# EAGLE schematic PlaneSimulatorIO (EAGLE 9.6.2)
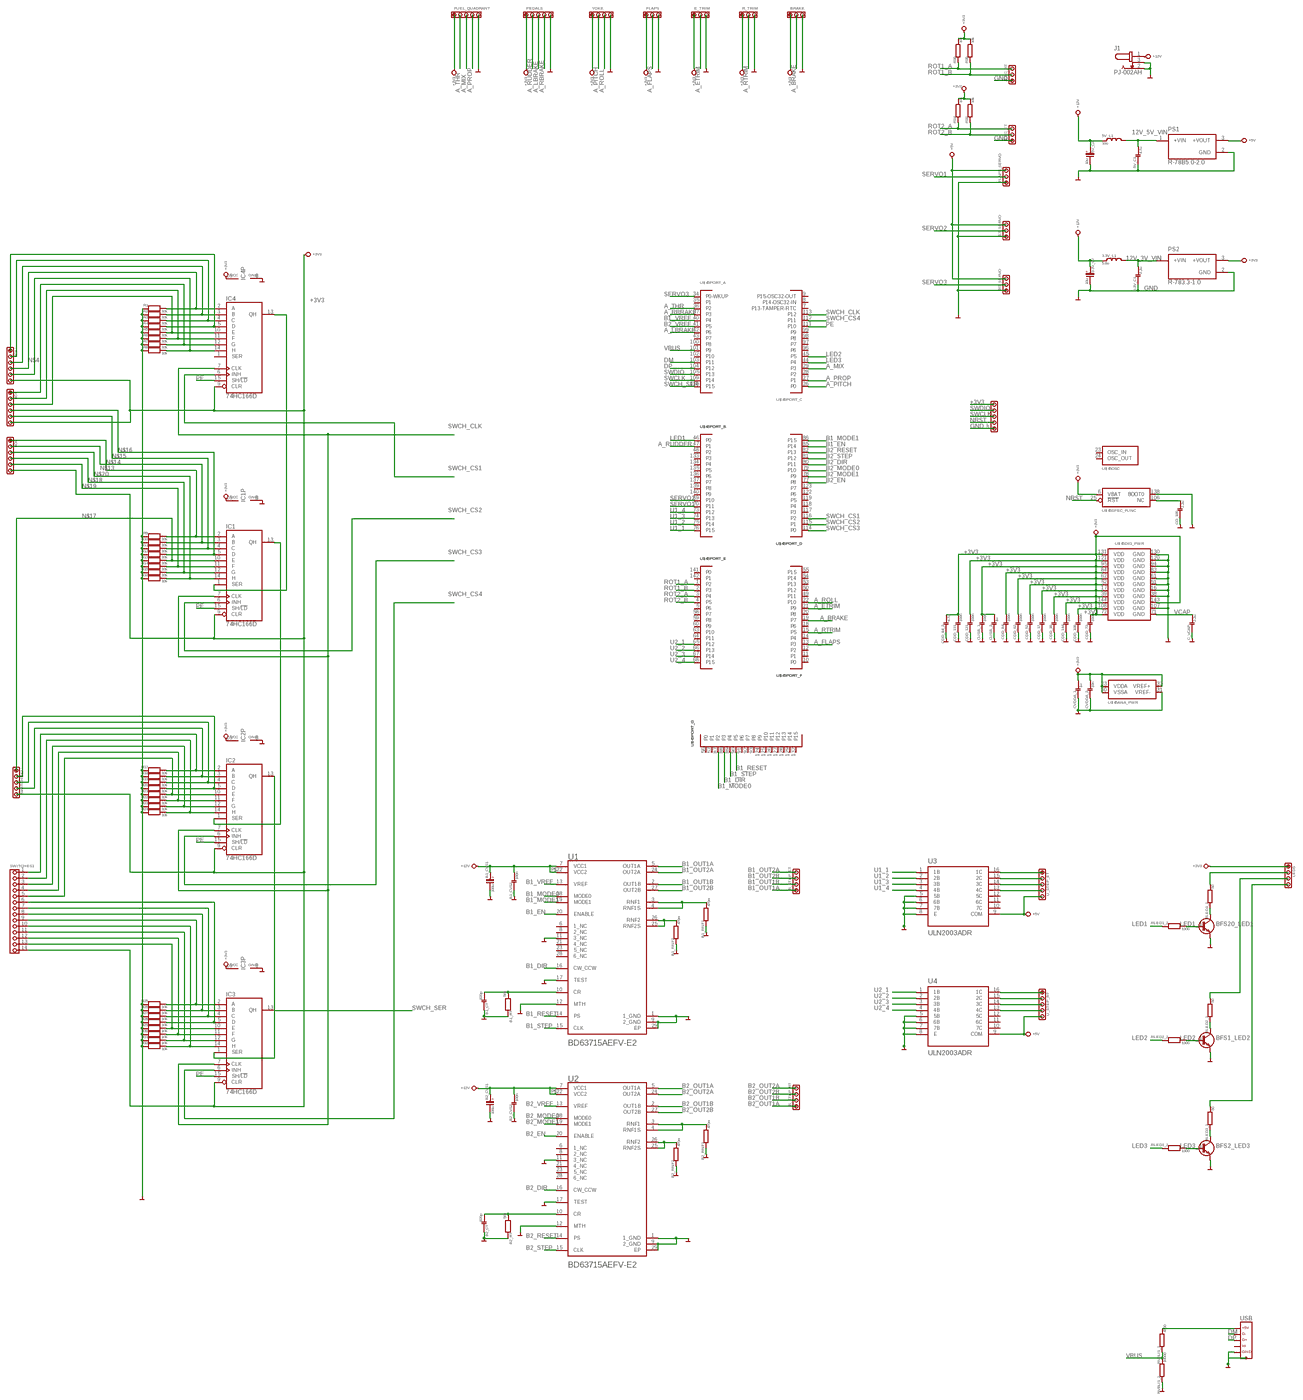
[diagram p0: schematic, sheet 1, overview]
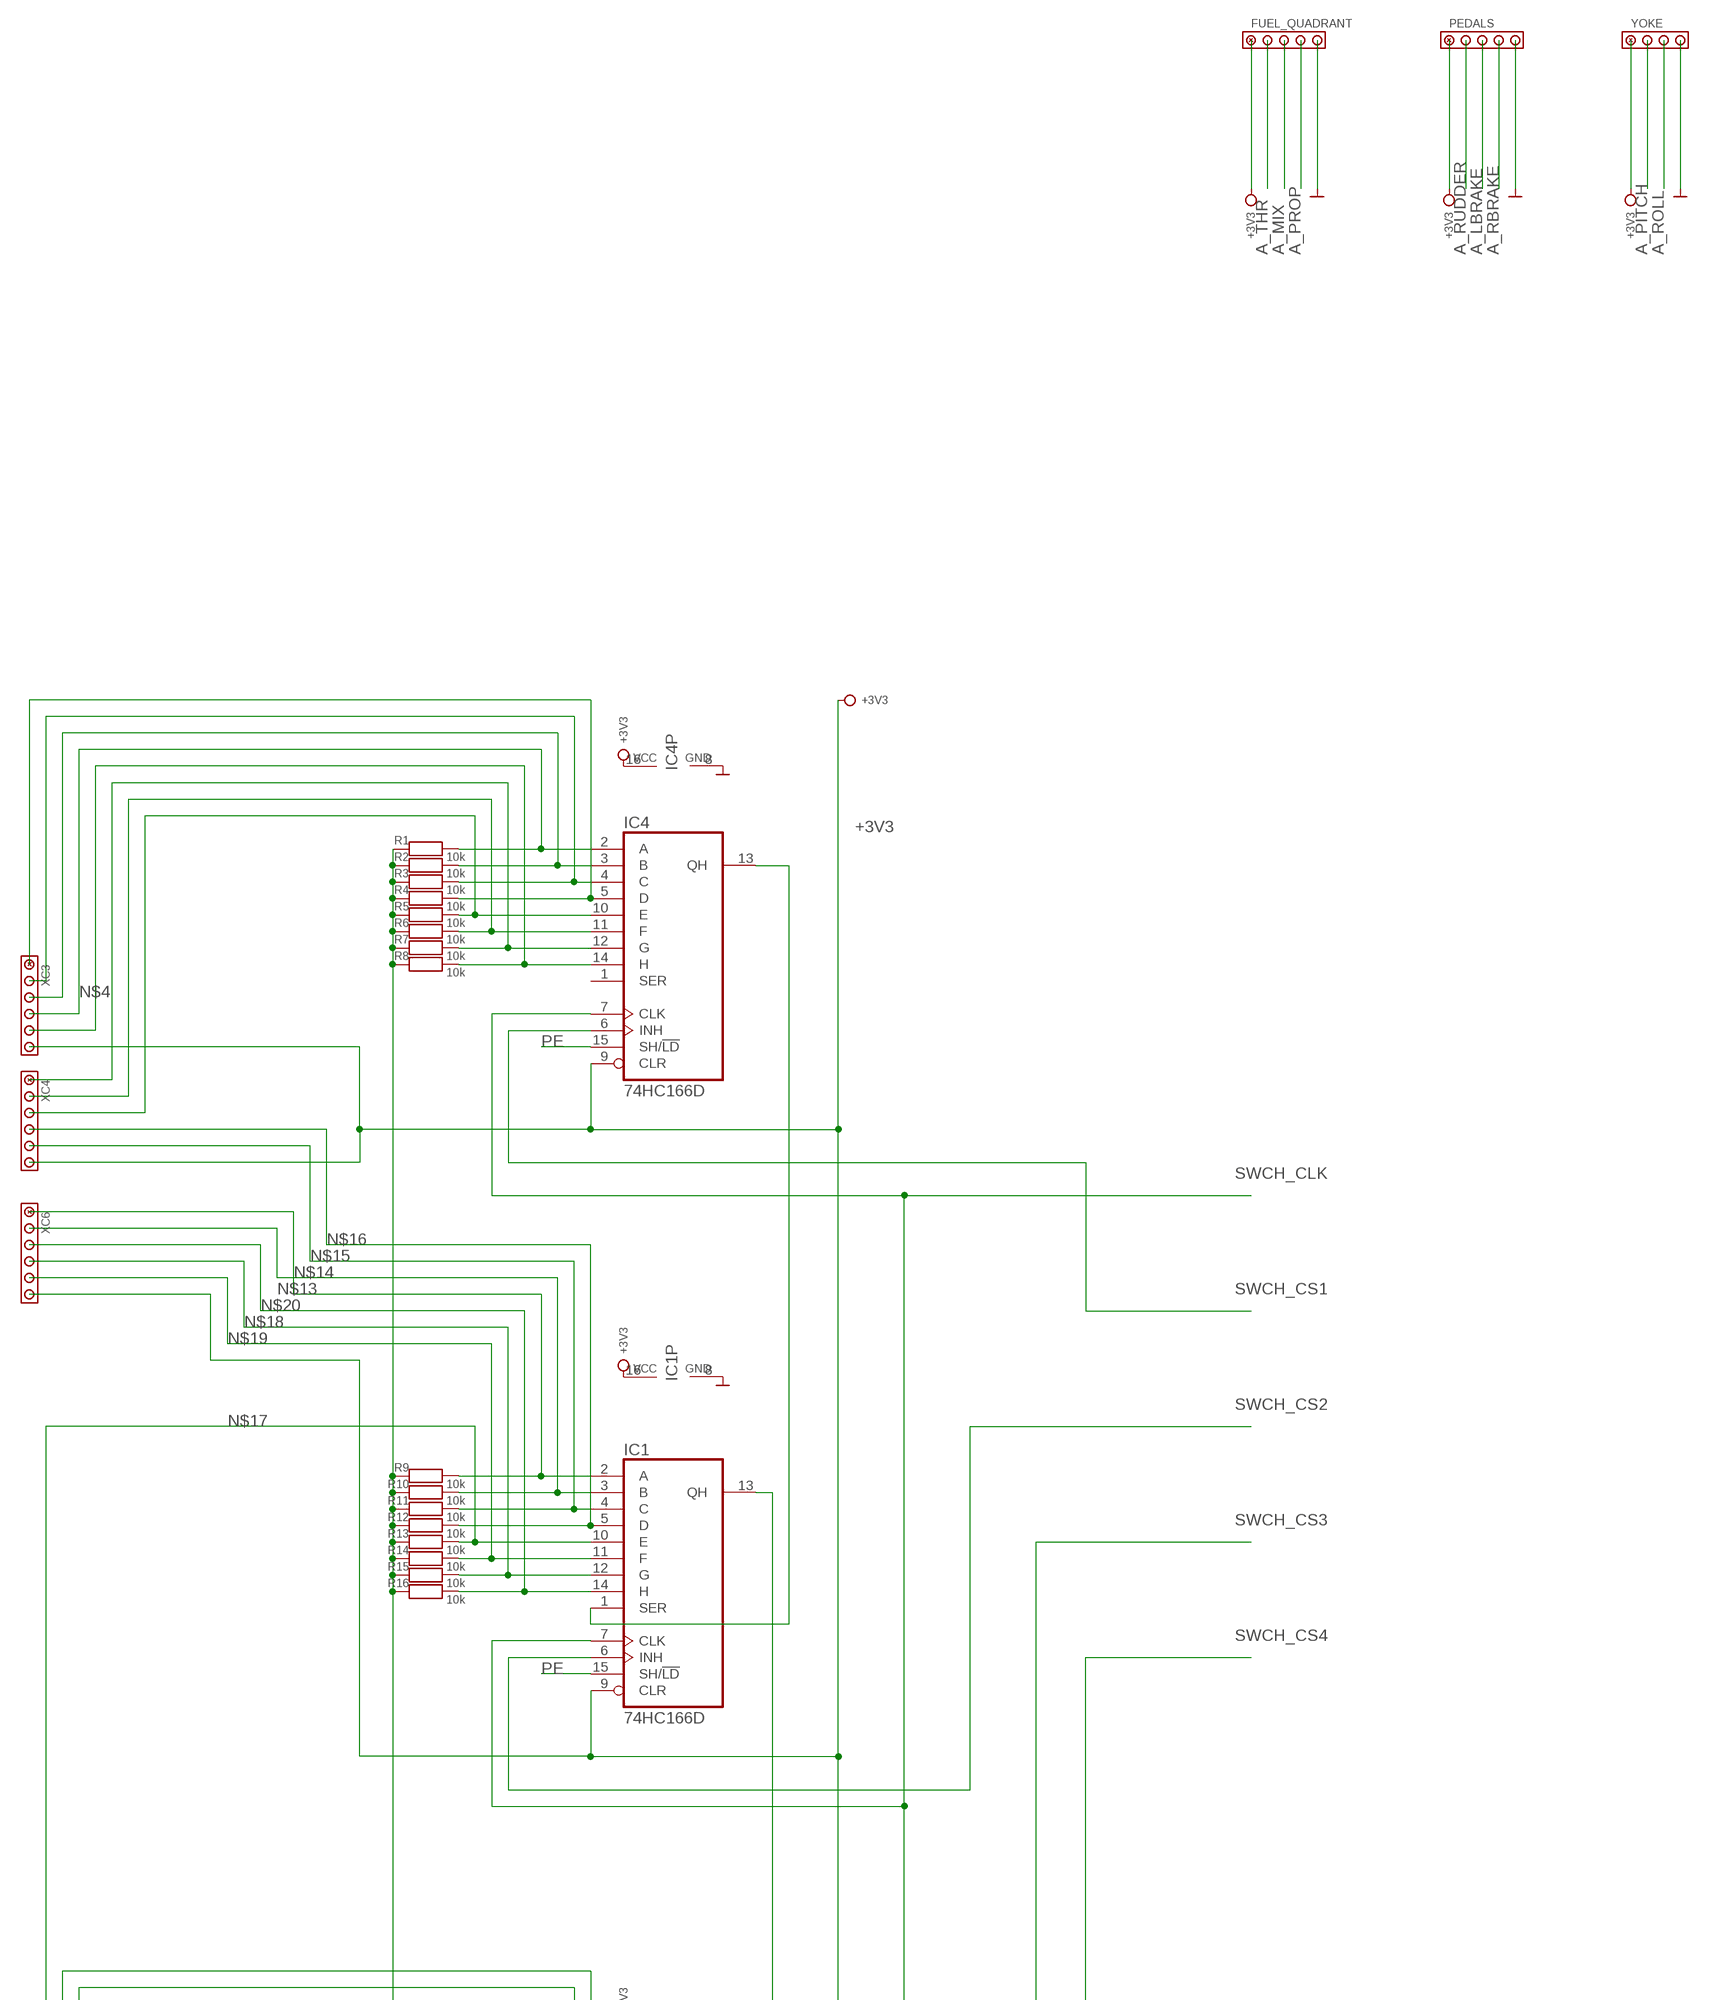
[diagram p1: schematic, sheet 1, part 1 of 4]
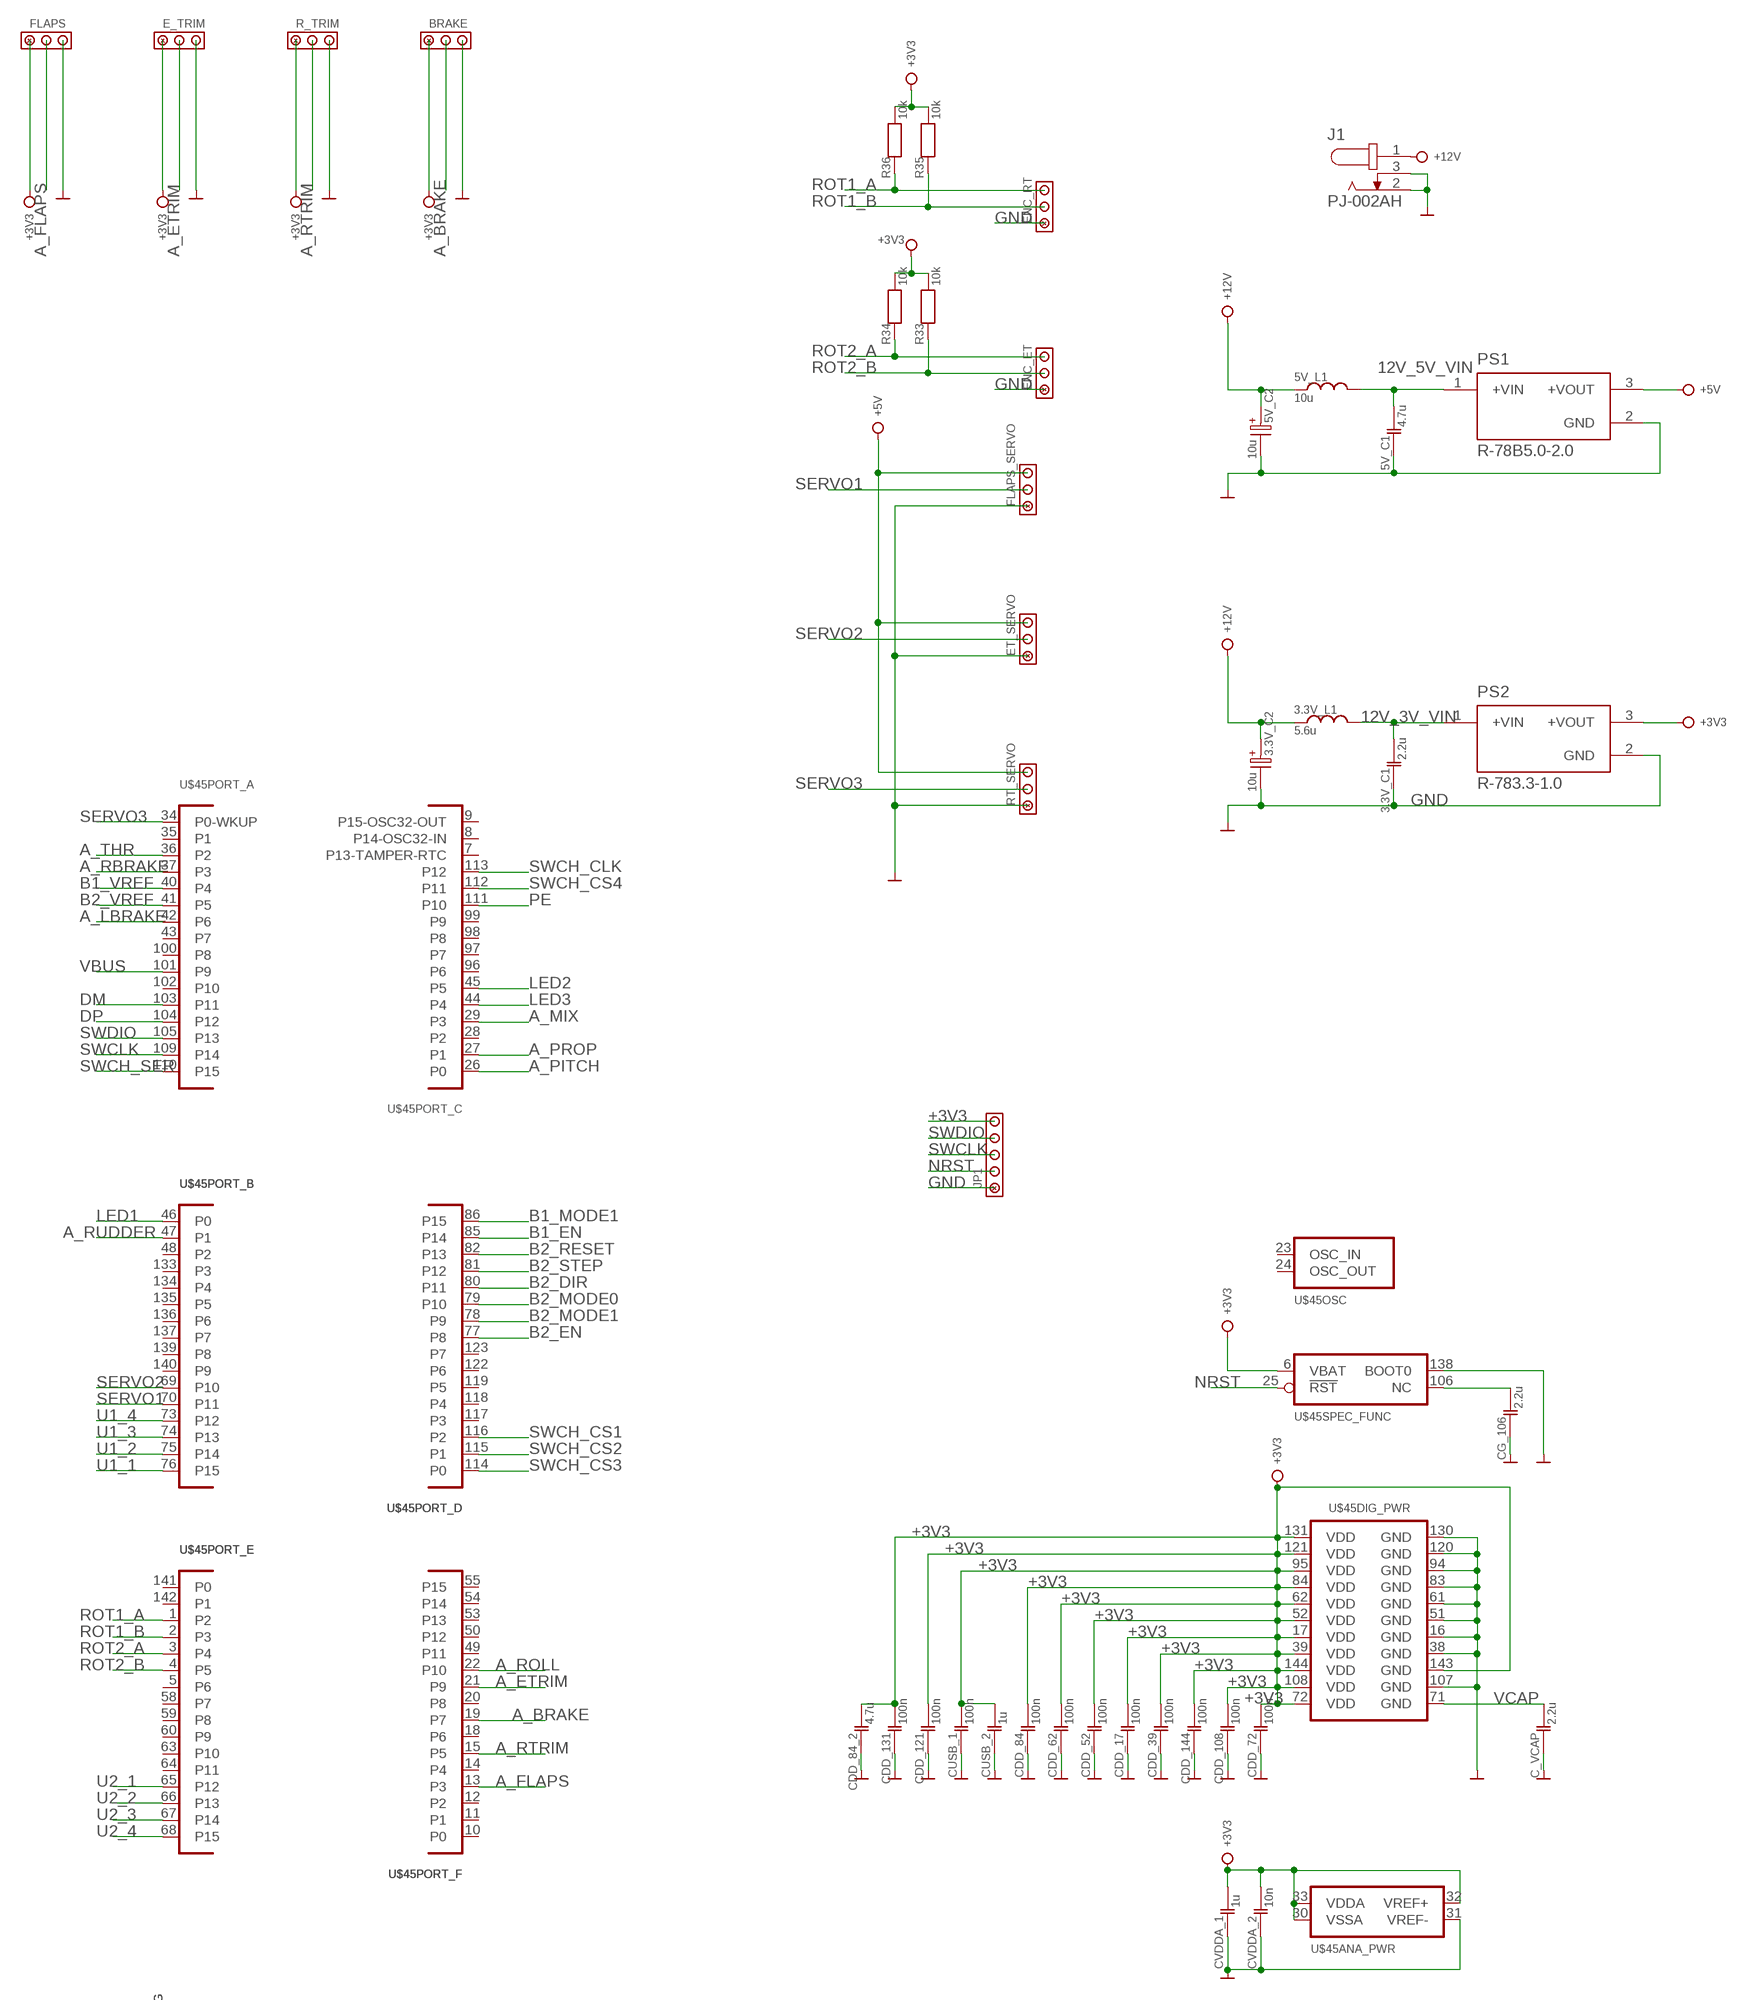
[diagram p2: schematic, sheet 1, part 2 of 4]
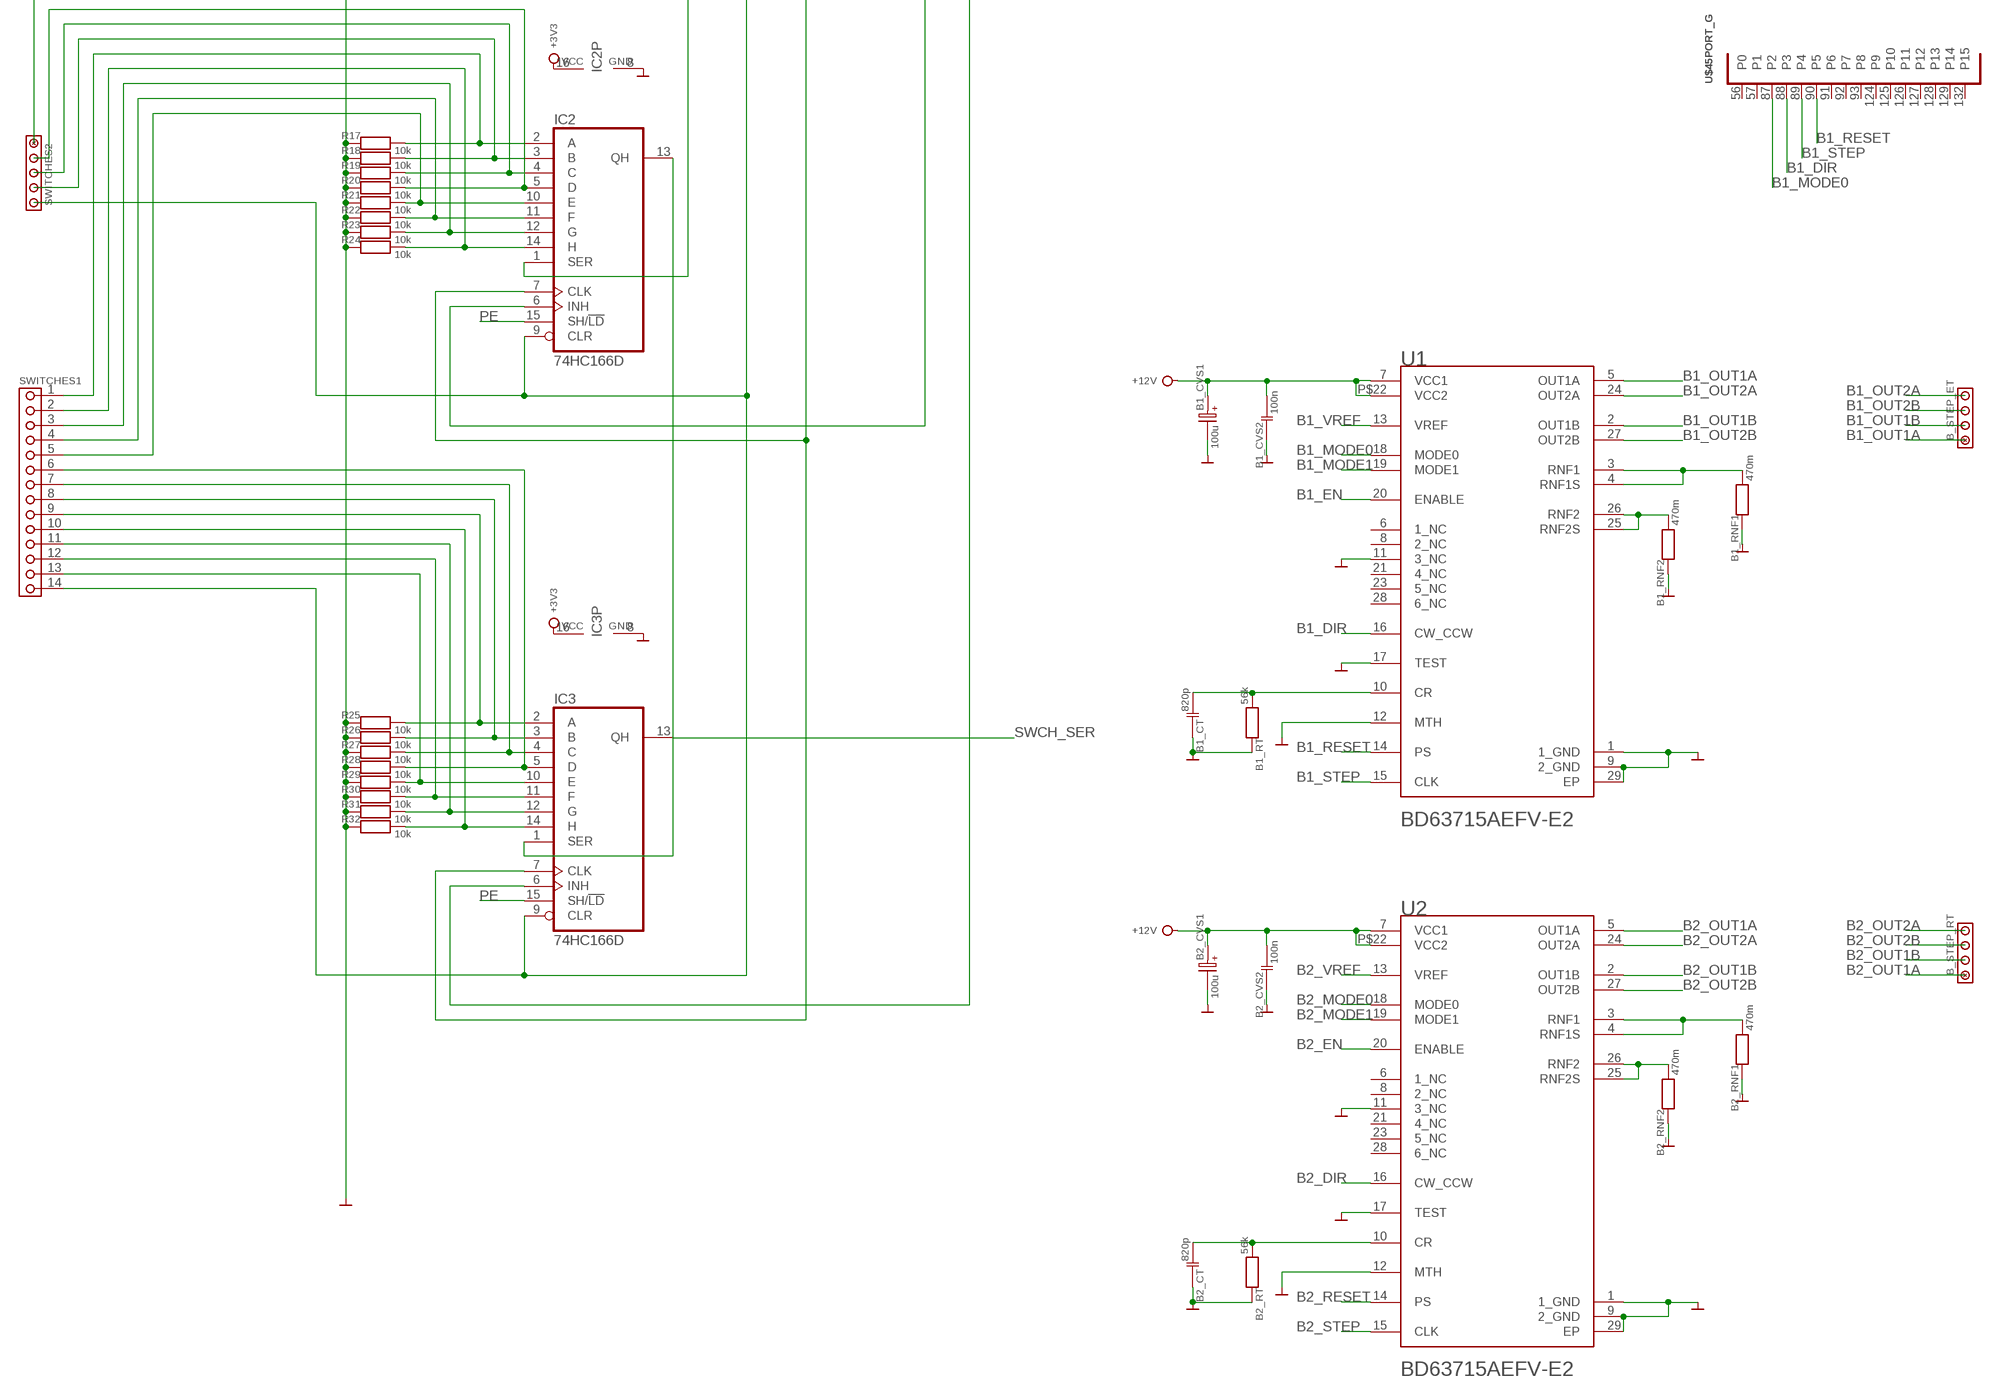
[diagram p3: schematic, sheet 1, part 3 of 4]
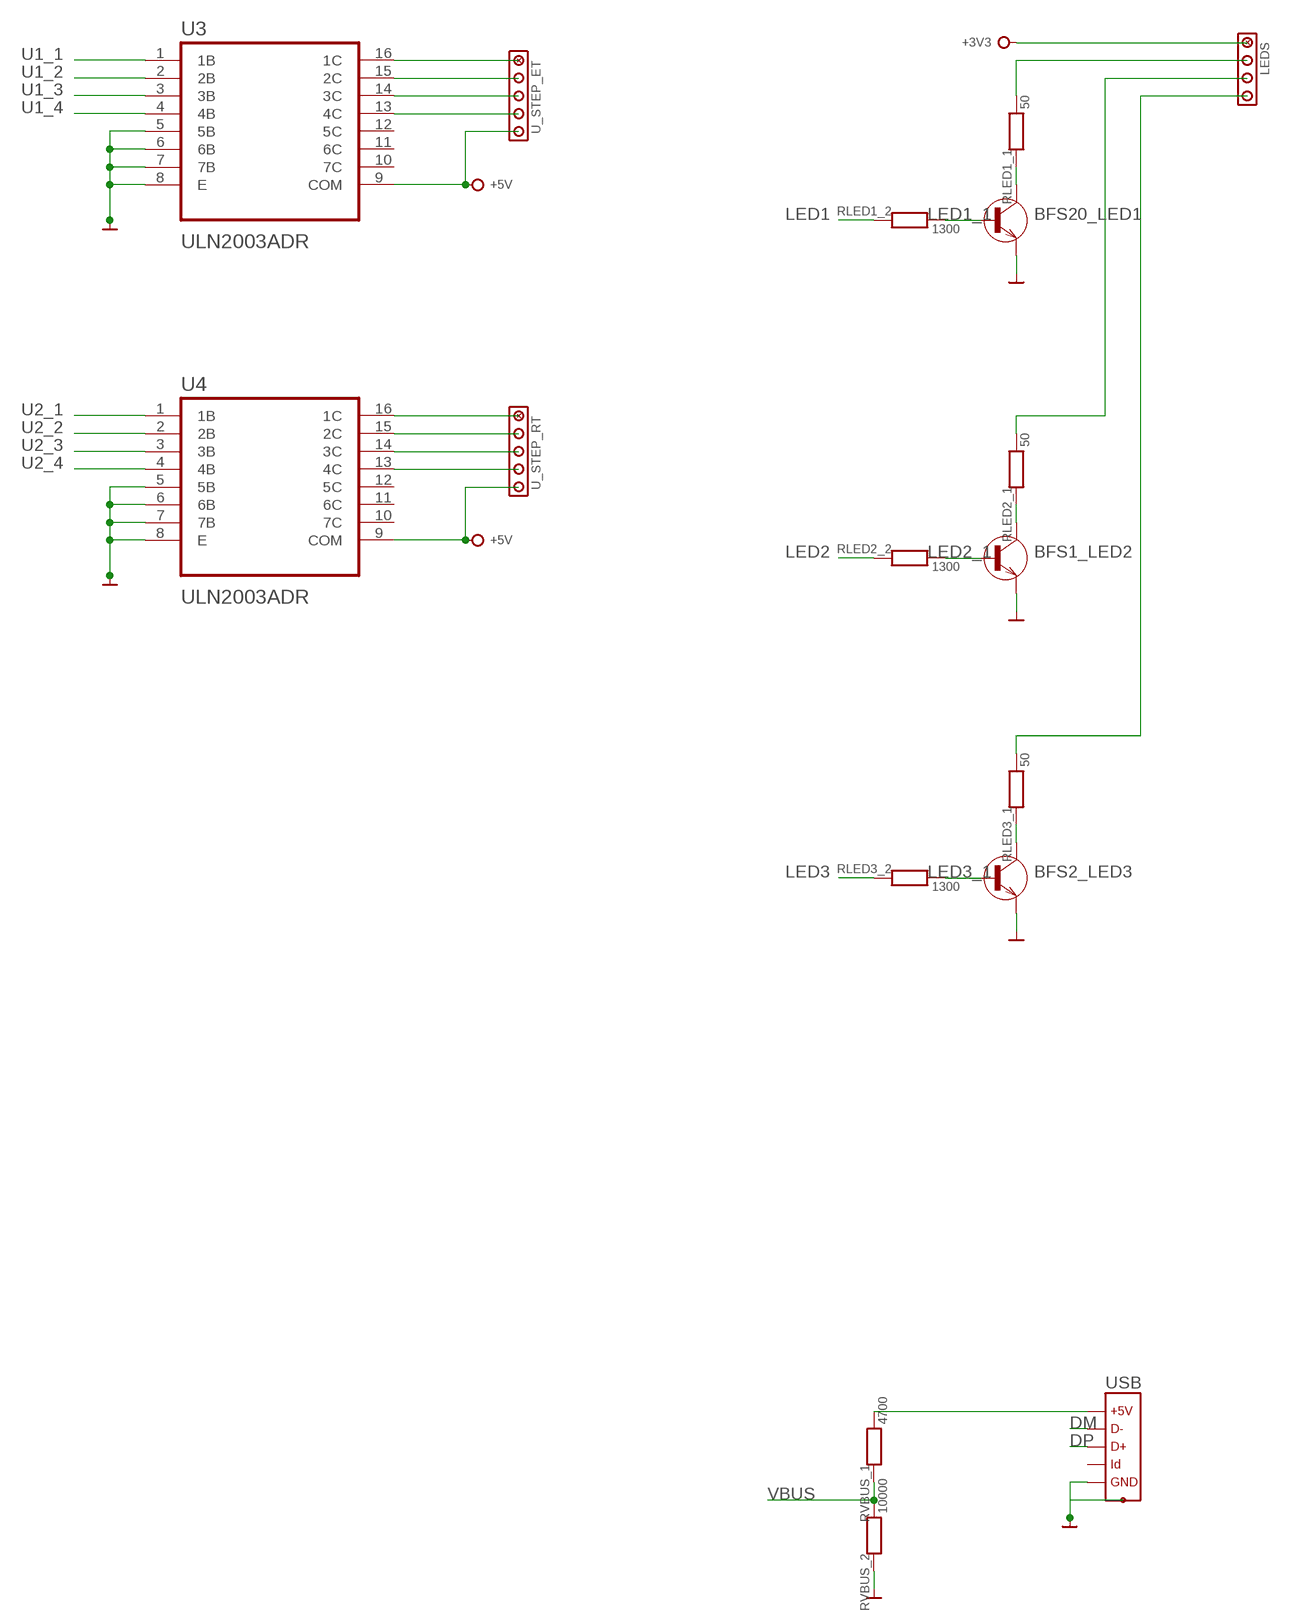
[diagram p4: schematic, sheet 1, part 4 of 4]

## Parts
3.3V_C1  2.2u  CK1206  [1206]
3.3V_C2  10u  CE10/5.0  [EC10-5]
3.3V_L1  5.6u  L-0805  [0805]
5V_C1  4.7u  CK1206  [1206]
5V_C2  10u  CE10/5.0  [EC10-5]
5V_L1  10u  L-DR74  [DR74]
B1_CT  820p  CK0603  [0603]
B1_CVS1  100u  CE10/5.0  [EC10-5]
B1_CVS2  100n  CK0603  [0603]
B1_RNF1  470m  R1206  [1206]
B1_RNF2  470m  R1206  [1206]
B1_RT  56k  R0603  [0603]
B2_CT  820p  CK0603  [0603]
B2_CVS1  100u  CE10/5.0  [EC10-5]
B2_CVS2  100n  CK0603  [0603]
B2_RNF1  470m  R1206  [1206]
B2_RNF2  470m  R1206  [1206]
B2_RT  56k  R0603  [0603]
B_STEP_ET  MCV/04  [MCV4]
B_STEP_RT  MCV/04  [MCV4]
BFS1_LED2  #NPNSOT23-3L  [SOT23-3L]
BFS2_LED3  #NPNSOT23-3L  [SOT23-3L]
BFS20_LED1  #NPNSOT23-3L  [SOT23-3L]
BRAKE  MCV/03  [MCV3]
C_VCAP  2.2u  CK0603  [0603]
CDD_17  100n  CK0603  [0603]
CDD_39  100n  CK0603  [0603]
CDD_52  100n  CK0603  [0603]
CDD_62  100n  CK0603  [0603]
CDD_72  100n  CK0603  [0603]
CDD_84  100n  CK0603  [0603]
CDD_84_2  4.7u  CK0603  [0603]
CDD_108  100n  CK0603  [0603]
CDD_121  100n  CK0603  [0603]
CDD_131  100n  CK0603  [0603]
CDD_144  100n  CK0603  [0603]
CG_106  2.2u  CK0603  [0603]
CUSB_1  100n  CK0603  [0603]
CUSB_2  1u  CK0603  [0603]
CVDDA_1  1u  CK0603  [0603]
CVDDA_2  10n  CK0603  [0603]
E_TRIM  MCV/03  [MCV3]
ENC_ET  MCV/03  [MCV3]
ENC_RT  MCV/03  [MCV3]
ET_SERVO  MCV/03  [MCV3]
FLAPS  MCV/03  [MCV3]
FLAPS_SERVO  MCV/03  [MCV3]
FUEL_QUADRANT  MCV/05  [MCV5]
IC1  74HC166D  [SO16]
IC2  74HC166D  [SO16]
IC3  74HC166D  [SO16]
IC4  74HC166D  [SO16]
J1  PJ-002AH  [CUI_PJ-002AH]
JP1  JP_05JP_05-2.54  [JP_05]
LEDS  MCV/04  [MCV4]
PEDALS  MCV/05  [MCV5]
PS1  R-78B5.0-2.0  [CONV_R-78B5.0-2.0]
PS2  R-783.3-1.0  [CONV_R-783.3-1.0]
R1  10k  R0603  [0603]
R2  10k  R0603  [0603]
R3  10k  R0603  [0603]
R4  10k  R0603  [0603]
R5  10k  R0603  [0603]
R6  10k  R0603  [0603]
R7  10k  R0603  [0603]
R8  10k  R0603  [0603]
R9  10k  R0603  [0603]
R10  10k  R0603  [0603]
R11  10k  R0603  [0603]
R12  10k  R0603  [0603]
R13  10k  R0603  [0603]
R14  10k  R0603  [0603]
R15  10k  R0603  [0603]
R16  10k  R0603  [0603]
R17  10k  R0603  [0603]
R18  10k  R0603  [0603]
R19  10k  R0603  [0603]
R20  10k  R0603  [0603]
R21  10k  R0603  [0603]
R22  10k  R0603  [0603]
R23  10k  R0603  [0603]
R24  10k  R0603  [0603]
R25  10k  R0603  [0603]
R26  10k  R0603  [0603]
R27  10k  R0603  [0603]
R28  10k  R0603  [0603]
R29  10k  R0603  [0603]
R30  10k  R0603  [0603]
R31  10k  R0603  [0603]
R32  10k  R0603  [0603]
R33  10k  R0603  [0603]
R34  10k  R0603  [0603]
R35  10k  R0603  [0603]
R36  10k  R0603  [0603]
R_TRIM  MCV/03  [MCV3]
RLED1_1  50  R0603  [0603]
RLED1_2  1300  R0603  [0603]
RLED2_1  50  R0603  [0603]
RLED2_2  1300  R0603  [0603]
RLED3_1  50  R0603  [0603]
RLED3_2  1300  R0603  [0603]
RT_SERVO  MCV/03  [MCV3]
RVBUS_1  4700  R0603  [0603]
RVBUS_2  10000  R0603  [0603]
SWITCHES1  14MCV3.81  [MCV14]
SWITCHES2  MCV/05  [MCV5]
U1  ROHM_BD63715AEFV-E2ROHM_BD63715AEFV-E2_0_3  [ROHM_BD63715AEFV-E2_3]
U2  ROHM_BD63715AEFV-E2ROHM_BD63715AEFV-E2_0_3  [ROHM_BD63715AEFV-E2_3]
U3  ULN2003ADR  [SOIC127P600X175-16N]
U4  ULN2003ADR  [SOIC127P600X175-16N]
U$45  STM32F103ZE  [SQFP-S-20X20-144]
U_STEP_ET  MCV/05  [MCV5]
U_STEP_RT  MCV/05  [MCV5]
USB  USB_5PIN_10118192-0001LF  [USB-MICRO-H_10118192-0001LF]
XC3  MCV/06  [MCV6]
XC4  MCV/06  [MCV6]
XC6  MCV/06  [MCV6]
YOKE  MCV/04  [MCV4]

## Nets
12V_3V_VIN: 3.3V_C1.2 3.3V_L1.2 PS2.1(+VIN)
12V_5V_VIN: 5V_C1.2 5V_L1.2 PS1.1(+VIN)
+3V3: BRAKE.1 CDD_17.2 CDD_39.2 CDD_52.2 CDD_62.2 CDD_72.2 CDD_84.2 CDD_84_2.2 CDD_108.2 CDD_121.2 CDD_131.2 CDD_144.2 CUSB_1.2 CUSB_2.2 CVDDA_1.2 CVDDA_2.2 E_TRIM.1 FLAPS.1 FUEL_QUADRANT.1 IC1.9(CLR) IC1.16(VCC) IC2.9(CLR) IC2.16(VCC) IC3.9(CLR) IC3.16(VCC) IC4.9(CLR) IC4.16(VCC) JP1.5 LEDS.1 PEDALS.1 PS2.3(+VOUT) R33.2 R34.2 R35.2 R36.2 R_TRIM.1 SWITCHES1.14 SWITCHES2.5 U$45.6(SPEC_FUNC:VBAT) U$45.17(DIG_PWR:VDD) U$45.30(ANA_PWR:VSSA) U$45.32(ANA_PWR:VREF+) U$45.33(ANA_PWR:VDDA) U$45.39(DIG_PWR:VDD) U$45.52(DIG_PWR:VDD) U$45.62(DIG_PWR:VDD) U$45.72(DIG_PWR:VDD) U$45.84(DIG_PWR:VDD) U$45.95(DIG_PWR:VDD) U$45.108(DIG_PWR:VDD) U$45.121(DIG_PWR:VDD) U$45.131(DIG_PWR:VDD) U$45.143(DIG_PWR:GND) U$45.144(DIG_PWR:VDD) XC3.6 XC4.6 XC6.6 YOKE.1
+5V: ET_SERVO.3 FLAPS_SERVO.3 PS1.3(+VOUT) RT_SERVO.3 U3.9(COM) U4.9(COM) U_STEP_ET.5 U_STEP_RT.5
+12V: 3.3V_C2.1 3.3V_L1.1 5V_C2.1 5V_L1.1 B1_CVS1.1 B1_CVS2.2 B2_CVS1.1 B2_CVS2.2 J1.1 U1.7(VCC1) U1.P$22(VCC2) U2.7(VCC1) U2.P$22(VCC2)
A_BRAKE: BRAKE.2 U$45.19(PORT_F:P7)
A_ETRIM: E_TRIM.2 U$45.21(PORT_F:P9)
A_FLAPS: FLAPS.2 U$45.13(PORT_F:P3)
A_LBRAKE: PEDALS.3 U$45.42(PORT_A:P6)
A_MIX: FUEL_QUADRANT.3 U$45.29(PORT_C:P3)
A_PITCH: U$45.26(PORT_C:P0) YOKE.2
A_PROP: FUEL_QUADRANT.4 U$45.27(PORT_C:P1)
A_RBRAKE: PEDALS.4 U$45.37(PORT_A:P3)
A_ROLL: U$45.22(PORT_F:P10) YOKE.3
A_RTRIM: R_TRIM.2 U$45.15(PORT_F:P5)
A_RUDDER: PEDALS.2 U$45.47(PORT_B:P1)
A_THR: FUEL_QUADRANT.2 U$45.36(PORT_A:P2)
B1_DIR: U1.16(CW_CCW) U$45.88(PORT_G:P3)
B1_EN: U1.20(ENABLE) U$45.85(PORT_D:P14)
B1_MODE0: U1.18(MODE0) U$45.87(PORT_G:P2)
B1_MODE1: U1.19(MODE1) U$45.86(PORT_D:P15)
B1_OUT1A: B_STEP_ET.1 U1.5(OUT1A)
B1_OUT1B: B_STEP_ET.2 U1.2(OUT1B)
B1_OUT2A: B_STEP_ET.4 U1.24(OUT2A)
B1_OUT2B: B_STEP_ET.3 U1.27(OUT2B)
B1_RESET: U1.14(PS) U$45.90(PORT_G:P5)
B1_STEP: U1.15(CLK) U$45.89(PORT_G:P4)
B1_VREF: U1.13(VREF) U$45.40(PORT_A:P4)
B2_DIR: U2.16(CW_CCW) U$45.80(PORT_D:P11)
B2_EN: U2.20(ENABLE) U$45.77(PORT_D:P8)
B2_MODE0: U2.18(MODE0) U$45.79(PORT_D:P10)
B2_MODE1: U2.19(MODE1) U$45.78(PORT_D:P9)
B2_OUT1A: B_STEP_RT.1 U2.5(OUT1A)
B2_OUT1B: B_STEP_RT.2 U2.2(OUT1B)
B2_OUT2A: B_STEP_RT.4 U2.24(OUT2A)
B2_OUT2B: B_STEP_RT.3 U2.27(OUT2B)
B2_RESET: U2.14(PS) U$45.82(PORT_D:P13)
B2_STEP: U2.15(CLK) U$45.81(PORT_D:P12)
B2_VREF: U2.13(VREF) U$45.41(PORT_A:P5)
DM: U$45.103(PORT_A:P11) USB.D-
DP: U$45.104(PORT_A:P12) USB.D+
GND: 3.3V_C1.1 3.3V_C2.2 5V_C1.1 5V_C2.2 B1_CT.1 B1_CVS1.2 B1_CVS2.1 B1_RNF1.1 B1_RNF2.1 B1_RT.1 B2_CT.1 B2_CVS1.2 B2_CVS2.1 B2_RNF1.1 B2_RNF2.1 B2_RT.1 BFS1_LED2.2(E) BFS2_LED3.2(E) BFS20_LED1.2(E) BRAKE.3 C_VCAP.1 CDD_17.1 CDD_39.1 CDD_52.1 CDD_62.1 CDD_72.1 CDD_84.1 CDD_84_2.1 CDD_108.1 CDD_121.1 CDD_131.1 CDD_144.1 CG_106.1 CUSB_1.1 CUSB_2.1 CVDDA_1.1 CVDDA_2.1 E_TRIM.3 ENC_ET.1 ENC_RT.1 ET_SERVO.1 FLAPS.3 FLAPS_SERVO.1 FUEL_QUADRANT.5 IC1.8(GND) IC2.8(GND) IC3.8(GND) IC4.8(GND) J1.2 J1.3 JP1.1 PEDALS.5 PS1.2(GND) PS2.2(GND) R1.1 R2.1 R3.1 R4.1 R5.1 R6.1 R7.1 R8.1 R9.1 R10.1 R11.1 R12.1 R13.1 R14.1 R15.1 R16.1 R17.1 R18.1 R19.1 R20.1 R21.1 R22.1 R23.1 R24.1 R25.1 R26.1 R27.1 R28.1 R29.1 R30.1 R31.1 R32.1 R_TRIM.3 RT_SERVO.1 RVBUS_2.1 U1.1(1_GND) U1.9(2_GND) U1.11(3_NC) U1.12(MTH) U1.17(TEST) U1.29(EP) U2.1(1_GND) U2.9(2_GND) U2.11(3_NC) U2.12(MTH) U2.17(TEST) U2.29(EP) U3.5(5B) U3.6(6B) U3.7(7B) U3.8(E) U4.5(5B) U4.6(6B) U4.7(7B) U4.8(E) U$45.16(DIG_PWR:GND) U$45.31(ANA_PWR:VREF-) U$45.38(DIG_PWR:GND) U$45.51(DIG_PWR:GND) U$45.61(DIG_PWR:GND) U$45.83(DIG_PWR:GND) U$45.94(DIG_PWR:GND) U$45.107(DIG_PWR:GND) U$45.120(DIG_PWR:GND) U$45.130(DIG_PWR:GND) U$45.138(SPEC_FUNC:BOOT0) USB.GND USB.S1(S) USB.S2(S) YOKE.4
LED1: RLED1_2.1 U$45.46(PORT_B:P0)
LED1_1: BFS20_LED1.1(B) RLED1_2.2
LED2: RLED2_2.1 U$45.45(PORT_C:P5)
LED2_1: BFS1_LED2.1(B) RLED2_2.2
LED3: RLED3_2.1 U$45.44(PORT_C:P4)
LED3_1: BFS2_LED3.1(B) RLED3_2.2
N$1: IC4.5(D) R4.2 XC3.1
N$2: IC4.4(C) R3.2 XC3.2
N$3: IC4.3(B) R2.2 XC3.3
N$4: IC4.2(A) R1.2 XC3.4
N$5: IC4.10(E) R5.2 XC4.3
N$6: IC4.11(F) R6.2 XC4.2
N$7: IC4.12(G) R7.2 XC4.1
N$8: IC4.14(H) R8.2 XC3.5
N$10: U4.16(1C) U_STEP_RT.1
N$11: U4.13(4C) U_STEP_RT.4
N$12: U4.14(3C) U_STEP_RT.3
N$13: IC1.2(A) R9.2 XC6.1
N$14: IC1.3(B) R10.2 XC6.2
N$15: IC1.4(C) R11.2 XC4.5
N$16: IC1.5(D) R12.2 XC4.4
N$17: IC1.10(E) R13.2 SWITCHES2.1
N$18: IC1.11(F) R14.2 XC6.5
N$19: IC1.12(G) R15.2 XC6.4
N$20: IC1.14(H) R16.2 XC6.3
N$21: U4.15(2C) U_STEP_RT.2
N$22: U3.16(1C) U_STEP_ET.1
N$23: U3.15(2C) U_STEP_ET.2
N$24: IC2.3(B) R18.2 SWITCHES2.4
N$25: IC2.4(C) R19.2 SWITCHES2.3
N$26: IC2.5(D) R20.2 SWITCHES2.2
N$27: IC2.2(A) R17.2 SWITCHES1.1
N$28: IC2.14(H) R24.2 SWITCHES1.2
N$29: IC2.12(G) R23.2 SWITCHES1.3
N$30: IC2.11(F) R22.2 SWITCHES1.4
N$31: IC2.10(E) R21.2 SWITCHES1.5
N$32: U3.14(3C) U_STEP_ET.3
N$33: U3.13(4C) U_STEP_ET.4
N$34: B2_CT.2 B2_RT.2 U2.10(CR)
N$35: B2_RNF1.2 U2.3(RNF1) U2.4(RNF1S)
N$36: IC3.5(D) R28.2 SWITCHES1.6
N$37: IC3.4(C) R27.2 SWITCHES1.7
N$38: IC3.3(B) R26.2 SWITCHES1.8
N$39: IC3.2(A) R25.2 SWITCHES1.9
N$40: IC3.14(H) R32.2 SWITCHES1.10
N$41: IC3.12(G) R31.2 SWITCHES1.11
N$42: IC3.11(F) R30.2 SWITCHES1.12
N$44: B2_RNF2.2 U2.25(RNF2S) U2.26(RNF2)
N$48: IC3.10(E) R29.2 SWITCHES1.13
N$54: CG_106.2 U$45.106(SPEC_FUNC:NC)
N$55: BFS1_LED2.3(C) RLED2_1.1
N$64: IC2.13(QH) IC3.1(SER)
N$65: IC1.13(QH) IC2.1(SER)
N$66: IC1.1(SER) IC4.13(QH)
N$77: B1_RNF1.2 U1.3(RNF1) U1.4(RNF1S)
N$78: B1_CT.2 B1_RT.2 U1.10(CR)
N$79: B1_RNF2.2 U1.25(RNF2S) U1.26(RNF2)
N$97: RVBUS_1.2 USB.VBUS
N$103: BFS20_LED1.3(C) RLED1_1.1
N$104: LEDS.2 RLED1_1.2
N$105: LEDS.3 RLED2_1.2
N$106: BFS2_LED3.3(C) RLED3_1.1
N$107: LEDS.4 RLED3_1.2
NRST: JP1.2 U$45.25(SPEC_FUNC:!RST)
PE: IC1.15(SH/!LD) IC2.15(SH/!LD) IC3.15(SH/!LD) IC4.15(SH/!LD) U$45.111(PORT_C:P10)
ROT1_A: ENC_RT.3 R36.1 U$45.1(PORT_E:P2)
ROT1_B: ENC_RT.2 R35.1 U$45.2(PORT_E:P3)
ROT2_A: ENC_ET.3 R34.1 U$45.3(PORT_E:P4)
ROT2_B: ENC_ET.2 R33.1 U$45.4(PORT_E:P5)
SERVO1: FLAPS_SERVO.2 U$45.70(PORT_B:P11)
SERVO2: ET_SERVO.2 U$45.69(PORT_B:P10)
SERVO3: RT_SERVO.2 U$45.34(PORT_A:P0-WKUP)
SWCH_CLK: IC1.7(CLK) IC2.7(CLK) IC3.7(CLK) IC4.7(CLK) U$45.113(PORT_C:P12)
SWCH_CS1: IC4.6(INH) U$45.116(PORT_D:P2)
SWCH_CS2: IC1.6(INH) U$45.115(PORT_D:P1)
SWCH_CS3: IC2.6(INH) U$45.114(PORT_D:P0)
SWCH_CS4: IC3.6(INH) U$45.112(PORT_C:P11)
SWCH_SER: IC3.13(QH) U$45.110(PORT_A:P15)
SWCLK: JP1.3 U$45.109(PORT_A:P14)
SWDIO: JP1.4 U$45.105(PORT_A:P13)
U1_1: U3.1(1B) U$45.76(PORT_B:P15)
U1_2: U3.2(2B) U$45.75(PORT_B:P14)
U1_3: U3.3(3B) U$45.74(PORT_B:P13)
U1_4: U3.4(4B) U$45.73(PORT_B:P12)
U2_1: U4.1(1B) U$45.65(PORT_E:P12)
U2_2: U4.2(2B) U$45.66(PORT_E:P13)
U2_3: U4.3(3B) U$45.67(PORT_E:P14)
U2_4: U4.4(4B) U$45.68(PORT_E:P15)
VBUS: RVBUS_1.1 RVBUS_2.2 U$45.101(PORT_A:P9)
VCAP: C_VCAP.2 U$45.71(DIG_PWR:GND)
Unconnected: IC4.1(SER) U1.6(1_NC) U1.8(2_NC) U1.21(4_NC) U1.23(5_NC) U1.28(6_NC) U2.6(1_NC) U2.8(2_NC) U2.21(4_NC) U2.23(5_NC) U2.28(6_NC) U3.10(7C) U3.11(6C) U3.12(5C) U4.10(7C) U4.11(6C) U4.12(5C) U$45.5(PORT_E:P6) U$45.7(PORT_C:P13-TAMPER-RTC) U$45.8(PORT_C:P14-OSC32-IN) U$45.9(PORT_C:P15-OSC32-OUT) U$45.10(PORT_F:P0) U$45.11(PORT_F:P1) U$45.12(PORT_F:P2) U$45.14(PORT_F:P4) U$45.18(PORT_F:P6) U$45.20(PORT_F:P8) U$45.23(OSC:OSC_IN) U$45.24(OSC:OSC_OUT) U$45.28(PORT_C:P2) U$45.35(PORT_A:P1) U$45.43(PORT_A:P7) U$45.48(PORT_B:P2) U$45.49(PORT_F:P11) U$45.50(PORT_F:P12) U$45.53(PORT_F:P13) U$45.54(PORT_F:P14) U$45.55(PORT_F:P15) U$45.56(PORT_G:P0) U$45.57(PORT_G:P1) U$45.58(PORT_E:P7) U$45.59(PORT_E:P8) U$45.60(PORT_E:P9) U$45.63(PORT_E:P10) U$45.64(PORT_E:P11) U$45.91(PORT_G:P6) U$45.92(PORT_G:P7) U$45.93(PORT_G:P8) U$45.96(PORT_C:P6) U$45.97(PORT_C:P7) U$45.98(PORT_C:P8) U$45.99(PORT_C:P9) U$45.100(PORT_A:P8) U$45.102(PORT_A:P10) U$45.117(PORT_D:P3) U$45.118(PORT_D:P4) U$45.119(PORT_D:P5) U$45.122(PORT_D:P6) U$45.123(PORT_D:P7) U$45.124(PORT_G:P9) U$45.125(PORT_G:P10) U$45.126(PORT_G:P11) U$45.127(PORT_G:P12) U$45.128(PORT_G:P13) U$45.129(PORT_G:P14) U$45.132(PORT_G:P15) U$45.133(PORT_B:P3) U$45.134(PORT_B:P4) U$45.135(PORT_B:P5) U$45.136(PORT_B:P6) U$45.137(PORT_B:P7) U$45.139(PORT_B:P8) U$45.140(PORT_B:P9) U$45.141(PORT_E:P0) U$45.142(PORT_E:P1) USB.ID

## Library data of the parts
3.3V_C1 5V_C1 B1_CT B1_CVS2 B2_CT B2_CVS2 C_VCAP CDD_17 CDD_39 CDD_52 CDD_62 CDD_72 CDD_84 CDD_84_2 CDD_108 CDD_121 CDD_131 CDD_144 CG_106 CUSB_1 CUSB_2 CVDDA_1 CVDDA_2 = #DISCRET:CK?: kondenzator keramicky
3.3V_C2 5V_C2 B1_CVS1 B2_CVS1 = #DISCRET:CE?
3.3V_L1 5V_L1 = #DISCRET:L-?
B1_RNF1 B1_RNF2 B1_RT B2_RNF1 B2_RNF2 B2_RT R1-R36 RLED1_1 RLED1_2 RLED2_1 RLED2_2 RLED3_1 RLED3_2 RVBUS_1 RVBUS_2 = #DISCRET:R?
B_STEP_ET B_STEP_RT LEDS YOKE = #CONNECT:?/04*
BFS1_LED2 BFS2_LED3 BFS20_LED1 = #trans:#NPN
BRAKE E_TRIM ENC_ET ENC_RT ET_SERVO FLAPS FLAPS_SERVO R_TRIM RT_SERVO = #CONNECT:?/03*
FUEL_QUADRANT PEDALS SWITCHES2 U_STEP_ET U_STEP_RT = #CONNECT:?/05*
IC1-IC4 = 74xx-eu:74*166: 8-bit parallel load SHIFT REGISTER
J1 = #$PJ-002AH:PJ-002AH: 2.0 mm Center Pin, 5.0 A, Right Angle, Through Hole, Dc Power Jack Connector Check availability <https://pricing.snapeda.com/parts/PJ-002AH/CUI%20Devices/view-part?ref=eda>; AVAILABILITY: In Stock; CUI_PURCHASE_URL: https://www.cuidevices.com/product/interconnect/connectors/dc-power-connectors/jacks/pj-002ah?utm_source=snapeda.com&utm_medium=referral&utm_campaign=snapedaBOM; DESCRIPTION: 2.0 x 6.5 mm, 5.0 A, Horizontal, Through Hole, Dc Power Jack Connector; MF: CUI Devices; MP: PJ-002AH; PACKAGE: None; PRICE: None; PURCHASE-URL: https://pricing.snapeda.com/search/part/PJ-002AH/?ref=eda
JP1 = #CONNECT:JP_05
PS1 = #$R-78B5.0-2.0:R-78B5.0-2.0: 2.0 Amp SIP3 Single Output Check availability <https://pricing.snapeda.com/parts/R-78B5.0-2.0/Recom%20Power/view-part?ref=eda>; AVAILABILITY: In Stock; DESCRIPTION: 2A DC/DC-Converter 'INNOLINE' SIP3 reg; MF: Recom Power; MP: R-78B5.0-2.0; PACKAGE: SIP-3 Recom Power; PRICE: None; PURCHASE-URL: https://pricing.snapeda.com/search/part/R-78B5.0-2.0/?ref=eda
PS2 = #$R-783.3-1.0:R-783.3-1.0: 1.0 Amp SIP3 Single Output Check availability <https://pricing.snapeda.com/parts/R-783.3-1.0/Recom%20Power/view-part?ref=eda>; AVAILABILITY: In Stock; DESCRIPTION: 1A DC/DC-Converter 'INNOLINE' SIP3 reg; MF: Recom Power; MP: R-783.3-1.0; PACKAGE: SIP-3 Recom Power; PRICE: None; PURCHASE-URL: https://pricing.snapeda.com/search/part/R-783.3-1.0/?ref=eda
SWITCHES1 = #CONNECT:*14*?
U1 U2 = #$Rohm - BD63715AEFV-E2(BD63511EFV-E2):ROHM_BD63715AEFV-E2: Bipolar Motor Driver DMOS Parallel 28-HTSSOP-B; AUTOMOTIVE: No; CENTROID_NOT_SPECIFIED: No; DATASHEET: https://fscdn.rohm.com/en/products/databook/datasheet/ic/motor/stepper/bd63715aefv-e.pdf; DEVICE_CLASS_L1: Integrated Circuits (ICs); DEVICE_CLASS_L2: Power Management ICs; DEVICE_CLASS_L3: Motor Drivers; DIGIKEY_DESCRIPTION: IC MTR DRV BIPLR 19-28V 28HTSSOP; DIGIKEY_PART_NUMBER: BD63715AEFV-E2CT-ND; FOOTPRINT_PARAMETERS_0: {"fp_type":"TSSOP2","params":{"N":{"nom":28,"long name":"Number of leads","min":null,"max":null,"short name":"N","type":"count"},"A":{"nom":false,"long name":"Height","min":false,"max":1000000,"short name":"A","type":"measurement"},"A1":{"nom":80000,"long name":"Package clearance","min":30000,"max":130000,"short name":"A1","type":"measurement"},"A2":{"nom":850000,"long name":"Package height","min":800000,"max":900000,"short name":"A2","type":"measurement"},"D":{"nom":9700000,"long name":"Package length","min":9600000,"max":9800000,"short name":"D","type":"measurement"},"E":{"nom":6400000,"long name":"Width /w leads","min":6200000,"max":6600000,"short name":"E","type":"measurement"},"E1":{"nom":4400000,"long name":"Package width","min":4300000,"max":4500000,"short name":"E1","type":"measurement"},"B":{"nom":240000,"long name":"Lead width","min":200000,"max":290000,"short name":"B","type":"measurement"},"C":{"nom":170000,"long name":"Lead thickness","min":140000,"max":220000,"short name":"C","type":"measurement"},"L":{"nom":500000,"long name":"Lead foot length","min":350000,"max":650000,"short name":"L","type":"measurement"},"e":{"nom":650000,"long name":"Lead pitch","min":null,"max":null,"short name":"e","type":"measurement"},"PHI":{"nom":false,"long name":"Lead angle","min":0,"max":8,"short name":"PHI","type":"measurement"},"HT":{"default":"Yes","long name":"Thermal pad","type":"multichoiceparent","short name":"HT","children":["D2","E2","PC"]},"offset x":{"nom":0,"long name":"X Center offset","min":null,"max":null,"short name":"offset x","type":"measurement"},"offset y":{"nom":0,"long name":"Y Center offset","min":null,"max":null,"short name":"offset y","type":"measurement"},"LS":{"default":"Rounded rectangle","long name":"Land shape","type":"multichoice","short name":"LS"},"LS1":{"default":"Rectangle","long name":"Land shape (Pin 1)","type":"multichoice","short name":"LS1"},"solder toe":{"nom":550000,"long name":"Solder fillet (toe)","min":null,"max":null,"short name":"solder toe","type":"fixedmeasurement"},"solder heel":{"nom":450000,"long name":"Solder fillet (heel)","min":null,"max":null,"short name":"solder heel","type":"fixedmeasurement"},"solder side":{"nom":50000,"long name":"Solder fillet (side)","min":null,"max":null,"short name":"solder side","type":"fixedmeasurement"},"courtyard":{"nom":500000,"long name":"Courtyard","min":null,"max":null,"short name":"courtyard","type":"fixedmeasurement"},"SF":{"default":"A (> 0.625mm pitch)","long name":"Packing level","type":"multichoiceparent","short name":"SF","help":"http://support.upverter.com/customer/portal/articles/978783-what-is-a-footprint-packing-level","children":["solder toe","solder heel","solder side","courtyard"]},"D2":{"nom":5500000,"long name":"Thermal pad length","min":false,"max":false,"short name":"D2","type":"measurement"},"E2":{"nom":2900000,"long name":"Thermal pad width","min":false,"max":false,"short name":"E2","type":"measurement"},"PC":{"long name":"Paste coverage (%)","type":"percentage","short name":"PC","value":40}}}; FOOTPRINT_PARAMETERS_1: {"fp_type":"TSSOP2","params":{"N":{"nom":28,"long name":"Number of leads","min":null,"max":null,"short name":"N","type":"count"},"A":{"nom":false,"long name":"Height","min":false,"max":1000000,"short name":"A","type":"measurement"},"A1":{"nom":80000,"long name":"Package clearance","min":30000,"max":130000,"short name":"A1","type":"measurement"},"A2":{"nom":850000,"long name":"Package height","min":800000,"max":900000,"short name":"A2","type":"measurement"},"D":{"nom":9700000,"long name":"Package length","min":9600000,"max":9800000,"short name":"D","type":"measurement"},"E":{"nom":6400000,"long name":"Width /w leads","min":6200000,"max":6600000,"short name":"E","type":"measurement"},"E1":{"nom":4400000,"long name":"Package width","min":4300000,"max":4500000,"short name":"E1","type":"measurement"},"B":{"nom":240000,"long name":"Lead width","min":200000,"max":290000,"short name":"B","type":"measurement"},"C":{"nom":170000,"long name":"Lead thickness","min":140000,"max":220000,"short name":"C","type":"measurement"},"L":{"nom":500000,"long name":"Lead foot length","min":350000,"max":650000,"short name":"L","type":"measurement"},"e":{"nom":650000,"long name":"Lead pitch","min":null,"max":null,"short name":"e","type":"measurement"},"PHI":{"nom":false,"long name":"Lead angle","min":0,"max":8,"short name":"PHI","type":"measurement"},"D2":{"nom":5500000,"long name":"Thermal pad length","min":false,"max":false,"short name":"D2","type":"measurement"},"E2":{"nom":2900000,"long name":"Thermal pad width","min":false,"max":false,"short name":"E2","type":"measurement"},"PC":{"long name":"Paste coverage (%)","type":"percentage","short name":"PC","value":40},"HT":{"default":"Yes","long name":"Thermal pad","type":"multichoiceparent","short name":"HT","children":["D2","E2","PC"]},"offset x":{"nom":0,"long name":"X Center offset","min":null,"max":null,"short name":"offset x","type":"measurement"},"offset y":{"nom":0,"long name":"Y Center offset","min":null,"max":null,"short name":"offset y","type":"measurement"},"LS":{"default":"Rounded rectangle","long name":"Land shape","type":"multichoice","short name":"LS"},"LS1":{"default":"Rectangle","long name":"Land shape (Pin 1)","type":"multichoice","short name":"LS1"},"solder toe":{"nom":550000,"long name":"Solder fillet (toe)","min":null,"max":null,"short name":"solder toe","type":"fixedmeasurement"},"solder heel":{"nom":450000,"long name":"Solder fillet (heel)","min":null,"max":null,"short name":"solder heel","type":"fixedmeasurement"},"solder side":{"nom":50000,"long name":"Solder fillet (side)","min":null,"max":null,"short name":"solder side","type":"fixedmeasurement"},"courtyard":{"nom":500000,"long name":"Courtyard","min":null,"max":null,"short name":"courtyard","type":"fixedmeasurement"},"SF":{"default":"A (> 0.625mm pitch)","long name":"Packing level","type":"multichoiceparent","short name":"SF","help":"http://support.upverter.com/customer/portal/articles/978783-what-is-a-footprint-packing-level","children":["solder toe","solder heel","solder side","courtyard"]}}}; FOOTPRINT_PARAMETERS_2: {"fp_type":"TSSOP2","params":{"N":{"nom":28,"long name":"Number of leads","min":null,"max":null,"short name":"N","type":"count"},"A":{"nom":false,"long name":"Height","min":false,"max":1000000,"short name":"A","type":"measurement"},"A1":{"nom":80000,"long name":"Package clearance","min":30000,"max":130000,"short name":"A1","type":"measurement"},"A2":{"nom":850000,"long name":"Package height","min":800000,"max":900000,"short name":"A2","type":"measurement"},"D":{"nom":9700000,"long name":"Package length","min":9600000,"max":9800000,"short name":"D","type":"measurement"},"E":{"nom":6400000,"long name":"Width /w leads","min":6200000,"max":6600000,"short name":"E","type":"measurement"},"E1":{"nom":4400000,"long name":"Package width","min":4300000,"max":4500000,"short name":"E1","type":"measurement"},"B":{"nom":240000,"long name":"Lead width","min":200000,"max":290000,"short name":"B","type":"measurement"},"C":{"nom":170000,"long name":"Lead thickness","min":140000,"max":220000,"short name":"C","type":"measurement"},"L":{"nom":500000,"long name":"Lead foot length","min":350000,"max":650000,"short name":"L","type":"measurement"},"e":{"nom":650000,"long name":"Lead pitch","min":null,"max":null,"short name":"e","type":"measurement"},"PHI":{"nom":false,"long name":"Lead angle","min":0,"max":8,"short name":"PHI","type":"measurement"},"D2":{"nom":5500000,"long name":"Thermal pad length","min":false,"max":false,"short name":"D2","type":"measurement"},"E2":{"nom":2900000,"long name":"Thermal pad width","min":false,"max":false,"short name":"E2","type":"measurement"},"PC":{"long name":"Paste coverage (%)","type":"percentage","short name":"PC","value":40},"HT":{"default":"Yes","long name":"Thermal pad","type":"multichoiceparent","short name":"HT","children":["D2","E2","PC"]},"offset x":{"nom":0,"long name":"X Center offset","min":null,"max":null,"short name":"offset x","type":"measurement"},"offset y":{"nom":0,"long name":"Y Center offset","min":null,"max":null,"short name":"offset y","type":"measurement"},"LS":{"default":"Rounded rectangle","long name":"Land shape","type":"multichoice","short name":"LS"},"LS1":{"default":"Rectangle","long name":"Land shape (Pin 1)","type":"multichoice","short name":"LS1"},"solder toe":{"nom":350000,"long name":"Solder fillet (toe)","min":null,"max":null,"short name":"solder toe","type":"fixedmeasurement"},"solder heel":{"nom":350000,"long name":"Solder fillet (heel)","min":null,"max":null,"short name":"solder heel","type":"fixedmeasurement"},"solder side":{"nom":30000,"long name":"Solder fillet (side)","min":null,"max":null,"short name":"solder side","type":"fixedmeasurement"},"courtyard":{"nom":250000,"long name":"Courtyard","min":null,"max":null,"short name":"courtyard","type":"fixedmeasurement"},"SF":{"default":"B (> 0.625mm pitch)","long name":"Packing level","type":"multichoiceparent","short name":"SF","help":"http://support.upverter.com/customer/portal/articles/978783-what-is-a-footprint-packing-level","children":["solder toe","solder heel","solder side","courtyard"]}}}; FOOTPRINT_PARAMETERS_3: {"fp_type":"TSSOP2","params":{"N":{"nom":28,"long name":"Number of leads","min":null,"max":null,"short name":"N","type":"count"},"A":{"nom":false,"long name":"Height","min":false,"max":1000000,"short name":"A","type":"measurement"},"A1":{"nom":80000,"long name":"Package clearance","min":30000,"max":130000,"short name":"A1","type":"measurement"},"A2":{"nom":850000,"long name":"Package height","min":800000,"max":900000,"short name":"A2","type":"measurement"},"D":{"nom":9700000,"long name":"Package length","min":9600000,"max":9800000,"short name":"D","type":"measurement"},"E":{"nom":6400000,"long name":"Width /w leads","min":6200000,"max":6600000,"short name":"E","type":"measurement"},"E1":{"nom":4400000,"long name":"Package width","min":4300000,"max":4500000,"short name":"E1","type":"measurement"},"B":{"nom":240000,"long name":"Lead width","min":200000,"max":290000,"short name":"B","type":"measurement"},"C":{"nom":170000,"long name":"Lead thickness","min":140000,"max":220000,"short name":"C","type":"measurement"},"L":{"nom":500000,"long name":"Lead foot length","min":350000,"max":650000,"short name":"L","type":"measurement"},"e":{"nom":650000,"long name":"Lead pitch","min":null,"max":null,"short name":"e","type":"measurement"},"PHI":{"nom":false,"long name":"Lead angle","min":0,"max":8,"short name":"PHI","type":"measurement"},"D2":{"nom":5500000,"long name":"Thermal pad length","min":false,"max":false,"short name":"D2","type":"measurement"},"E2":{"nom":2900000,"long name":"Thermal pad width","min":false,"max":false,"short name":"E2","type":"measurement"},"PC":{"long name":"Paste coverage (%)","type":"percentage","short name":"PC","value":40},"HT":{"default":"Yes","long name":"Thermal pad","type":"multichoiceparent","short name":"HT","children":["D2","E2","PC"]},"offset x":{"nom":0,"long name":"X Center offset","min":null,"max":null,"short name":"offset x","type":"measurement"},"offset y":{"nom":0,"long name":"Y Center offset","min":null,"max":null,"short name":"offset y","type":"measurement"},"LS":{"default":"Rounded rectangle","long name":"Land shape","type":"multichoice","short name":"LS"},"LS1":{"default":"Rectangle","long name":"Land shape (Pin 1)","type":"multichoice","short name":"LS1"},"solder toe":{"nom":150000,"long name":"Solder fillet (toe)","min":null,"max":null,"short name":"solder toe","type":"fixedmeasurement"},"solder heel":{"nom":250000,"long name":"Solder fillet (heel)","min":null,"max":null,"short name":"solder heel","type":"fixedmeasurement"},"solder side":{"nom":10000,"long name":"Solder fillet (side)","min":null,"max":null,"short name":"solder side","type":"fixedmeasurement"},"courtyard":{"nom":100000,"long name":"Courtyard","min":null,"max":null,"short name":"courtyard","type":"fixedmeasurement"},"SF":{"default":"C (> 0.625mm pitch)","long name":"Packing level","type":"multichoiceparent","short name":"SF","help":"http://support.upverter.com/customer/portal/articles/978783-what-is-a-footprint-packing-level","children":["solder toe","solder heel","solder side","courtyard"]}}}; FOOTPRINT_URL: https://fscdn.rohm.com/en/techdata_basic/ic/package/htssop-b28_1-e.pdf; FOOTPRINT_VARIANT_NAME_0: Recommended_Land_Pattern; FOOTPRINT_VARIANT_NAME_1: IPC_A; FOOTPRINT_VARIANT_NAME_2: IPC_B; FOOTPRINT_VARIANT_NAME_3: IPC_C; HEIGHT: 1mm; LEAD_FREE: Yes; MAX_POWER_DISSIPATION: 4.7W; MAX_SUPPLY_VOLTAGE: 28V; MF: Rohm; MFG_PACKAGE_IDENT: HTSSOP-B28; MFG_PACKAGE_IDENT_COMPONENT_ID: c60f3805d2df04bb; MFG_PACKAGE_IDENT_DATE: 0; MFG_PACKAGE_IDENT_REV: 0; MIN_SUPPLY_VOLTAGE: 19V; MOTOR_TYPE: Stepper; MOUSER_PART_NUMBER: 755-BD63715AEFV-E2; MPN: BD63715AEFV-E2; NOMINAL_SUPPLY_CURRENT: 2mA; NUMBER_OF_OUTPUTS: 2; OUTPUT_CURRENT: 1.2A; PACKAGE: HTSSOP28; PREFIX: U; ROHS: Yes; STANDOFF_HEIGHT: 0.03mm; TEMPERATURE_RANGE_HIGH: +85°C; TEMPERATURE_RANGE_LOW: -25°C; VERIFICATION_VERSION: 0.0.0.3
U3 U4 = #$ULN2003ADR:ULN2003ADR: Check availability <https://pricing.snapeda.com/parts/ULN2003ADR/Texas%20Instruments/view-part?ref=eda>; AVAILABILITY: In Stock; DESCRIPTION: 50-V, 7-ch darlington transistor array, -20C to 70C; MF: Texas Instruments; MP: ULN2003ADR; PACKAGE: SOIC-16 Texas Instruments; PRICE: None; PURCHASE-URL: https://pricing.snapeda.com/search/part/ULN2003ADR/?ref=eda
U$45 = #$stm32_lqfp144:STM32F103ZE: 72 MHz, 64KB RAM, 512 KB Flash
USB = #CONNECT:USB_5PIN_
XC3 XC4 XC6 = #CONNECT:?/06*